# Altium schematic sheet LCD_Player_V1.1.SchDoc
size A; SheetNumber: 1; SheetTotal: 1
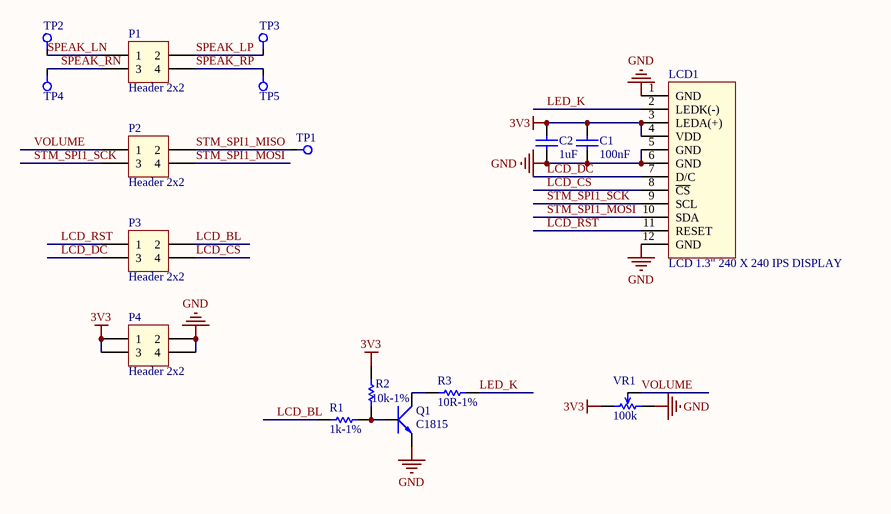
[diagram p0: LCD_Player_V1.1.SchDoc]

## Parts
C1  100nF  [Cap 0603]
C2  1uF  [Cap 0603]
LCD1  LCD 1.3" 240 X 240 IPS DISPLAY  [LCD 1.3inch IPS HD]
P1  Header 2x2  [Header 2mm 2x2]
P2  Header 2x2  [Header 2mm 2x2]
P3  Header 2x2  [Header 2mm 2x2]
P4  Header 2x2  [Header 2mm 2x2]
Q1  C1815  [SOT23B]
R1  1k-1%  [Res 0603]
R2  10k-1%  [Res 0603]
R3  10R-1%  [Res 0603]
TP1  TP  [TP]  (value not drawn)
TP2  TP  [TP]  (value not drawn)
TP3  TP  [TP]  (value not drawn)
TP4  TP  [TP]  (value not drawn)
TP5  TP  [TP]  (value not drawn)
VR1  100k  [Adjust Resistor Wheel]

## Nets
3V3: C1.1 C2.1 LCD1.3(LEDA(+)) LCD1.4(VDD) P4.1 P4.3 R2.2 VR1.1
GND: C1.2 C2.2 LCD1.1(GND) LCD1.5(GND) LCD1.6(GND) LCD1.12(GND) P4.2 P4.4 Q1.1(E) VR1.3
LCD_BL: P3.2 R1.1
LCD_CS: LCD1.8(~{CS}) P3.4
LCD_DC: LCD1.7(D/C) P3.3
LCD_RST: LCD1.11(RESET) P3.1
LED_K: LCD1.2(LEDK(-)) R3.1
SPEAK_LN: P1.1 TP2.1
SPEAK_LP: P1.2 TP3.1
SPEAK_RN: P1.3 TP4.1
SPEAK_RP: P1.4 TP5.1
STM_SPI1_MISO: P2.2 TP1.1
STM_SPI1_MOSI: LCD1.10(SDA) P2.4
STM_SPI1_SCK: LCD1.9(SCL) P2.3
VOLUME: P2.1 VR1.2
NetQ1_2: Q1.2(C) R3.2
NetQ1_3: Q1.3(B) R1.2 R2.1

## Library data of the parts
C1 C2 = Cap: Cap SMD
LCD1 = LCD 1.3" 240 X 240 IPS DISPLAY: This is a general LCD display Module, IPS screen, 1.3inch diagonal, 240*240 / resolution, with embedded controller, communicating via SPI interface
Q1 = C1815: NPN 600mW, ECB; Value: C1815
R1-R3 = Res: Res SMD
VR1 = Res Adjust: Adjust Resistor